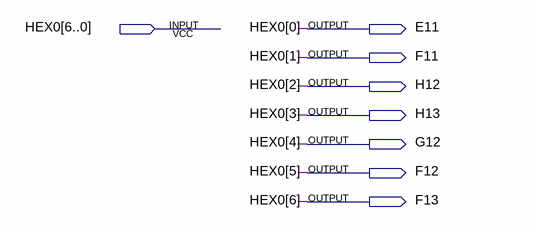
[diagram p0: schematic sheet]
// Quartus schematic Display0.bdf as structural Verilog: 0 symbols, 8 pins
module Display0 (
  input  [6:0] HEX0,
  output E11,
  output F11,
  output H12,
  output H13,
  output G12,
  output F12,
  output F13
);


  assign E11 = HEX0[0];
  assign F11 = HEX0[1];
  assign F12 = HEX0[5];
  assign F13 = HEX0[6];
  assign G12 = HEX0[4];
  assign H12 = HEX0[2];
  assign H13 = HEX0[3];
endmodule
